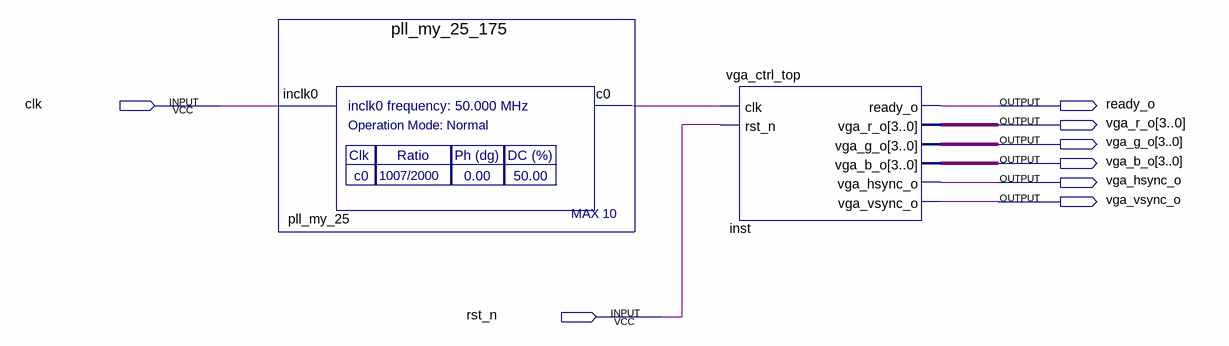
[diagram p0: schematic sheet]
// Quartus schematic vga_ctrl_top_25_175.bdf as structural Verilog: 2 symbols, 8 pins
module vga_ctrl_top_25_175 (
  input  clk,
  input  rst_n,
  output ready_o,
  output [3:0] vga_r_o,
  output [3:0] vga_g_o,
  output [3:0] vga_b_o,
  output vga_hsync_o,
  output vga_vsync_o
);

  wire pll_my_25_c0;

  pll_my_25_175 pll_my_25 (.inclk0(clk), .c0(pll_my_25_c0));
  vga_ctrl_top inst (
    .clk(pll_my_25_c0), .rst_n(rst_n), .ready_o(ready_o), .vga_r_o(vga_r_o), .vga_g_o(vga_g_o),
    .vga_b_o(vga_b_o), .vga_hsync_o(vga_hsync_o), .vga_vsync_o(vga_vsync_o));
endmodule
